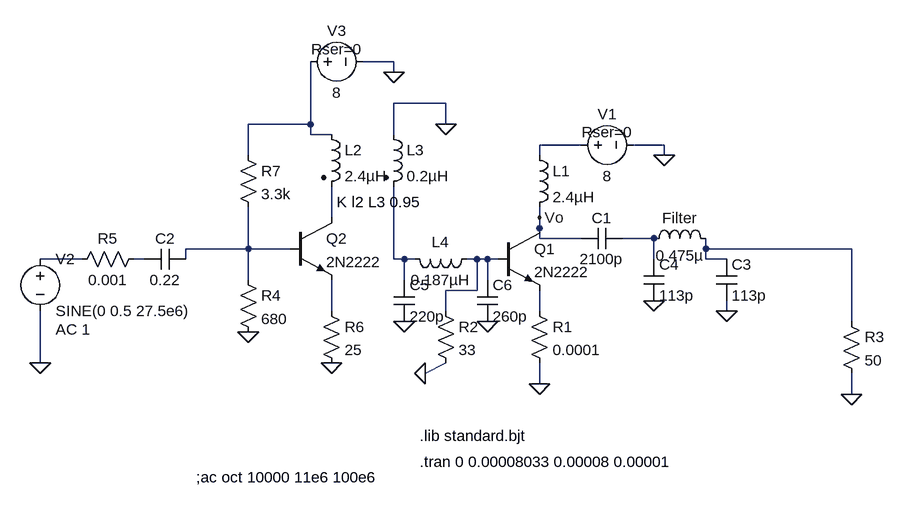
[diagram p0: schematic chian-27Mhz-improve.asc]
chian-27Mhz-improve.asc, the LTspice schematic file:
Version 4
SHEET 1 880 680
WIRE -32 -160 -80 -160
WIRE -32 -144 -32 -160
WIRE 48 -96 -32 -96
WIRE -160 -64 -160 -160
WIRE -160 -64 -256 -64
WIRE 48 -64 48 -96
WIRE -160 -48 -160 -64
WIRE -128 -48 -160 -48
WIRE -32 -48 -32 -96
WIRE 256 -32 192 -32
WIRE 384 -32 336 -32
WIRE -256 -16 -256 -64
WIRE 192 -16 192 -32
WIRE 384 -16 384 -32
WIRE -128 80 -128 32
WIRE 192 80 192 64
WIRE 192 96 192 80
WIRE 192 112 192 96
WIRE 256 112 192 112
WIRE 368 112 320 112
WIRE -256 128 -256 64
WIRE -256 128 -352 128
WIRE -192 128 -256 128
WIRE 448 128 448 112
WIRE 672 128 448 128
WIRE -512 144 -576 144
WIRE -416 144 -432 144
WIRE -352 144 -352 128
WIRE -32 144 -32 32
WIRE -16 144 -32 144
WIRE 0 144 -16 144
WIRE 96 144 80 144
WIRE 112 144 96 144
WIRE 128 144 112 144
WIRE 368 144 368 112
WIRE 448 144 448 128
WIRE 480 144 448 144
WIRE -256 176 -256 128
WIRE -16 176 -16 144
WIRE 112 176 112 144
WIRE 96 192 96 144
WIRE 96 192 48 192
WIRE -128 224 -128 176
WIRE 48 224 48 192
WIRE 192 224 192 192
WIRE 480 224 480 208
WIRE 672 240 672 128
WIRE -576 304 -576 224
WIRE 16 320 48 304
WIRE 192 336 192 304
WIRE 672 352 672 320
FLAG 192 336 0
FLAG 480 224 0
FLAG 384 -16 0
FLAG 672 352 0
FLAG -576 304 0
FLAG 192 80 Vo
FLAG 368 208 0
FLAG 16 320 0
FLAG -32 -144 0
FLAG -128 304 0
FLAG -256 256 0
FLAG 48 -64 0
FLAG 112 240 0
FLAG -16 240 0
SYMBOL res 176 208 R0
SYMATTR InstName R1
SYMATTR Value 0.0001
SYMATTR SpiceLine tol=1% pwr=1
SYMBOL ind 176 -32 R0
SYMATTR InstName L1
SYMATTR Value 2.4µH
SYMATTR SpiceLine Ipk=3 Rser=0.0478 Rpar=1e22 Cpar=0
SYMBOL ind 352 128 R270
WINDOW 0 32 56 VTop 2
WINDOW 3 5 56 VBottom 2
SYMATTR InstName Filter
SYMATTR Value 0.475µ
SYMATTR SpiceLine Ipk=1 Rser=0.03 Rpar=1e4 Cpar=0.3p
SYMBOL cap 464 144 R0
SYMATTR InstName C3
SYMATTR Value 113p
SYMATTR SpiceLine V=100 Irms=0.7 Rser=0.03 Lser=0 Rpar=1e5 Cpar=0
SYMBOL npn 128 96 R0
SYMATTR InstName Q1
SYMATTR Value 2N2222
SYMBOL res 656 224 R0
SYMATTR InstName R3
SYMATTR Value 50
SYMATTR SpiceLine tol=1% pwr=1
SYMBOL voltage 240 -32 R270
WINDOW 0 32 56 VTop 2
WINDOW 3 -32 56 VBottom 2
WINDOW 123 0 0 Left 2
WINDOW 39 4 56 VTop 2
SYMATTR InstName V1
SYMATTR Value 8
SYMATTR SpiceLine Rser=0
SYMBOL voltage -576 128 R0
WINDOW 123 24 124 Left 2
WINDOW 39 24 152 Left 2
SYMATTR Value2 AC 1
SYMATTR InstName V2
SYMATTR Value SINE(0 0.5 27.5e6)
SYMBOL res -528 160 R270
WINDOW 0 32 56 VTop 2
WINDOW 3 0 56 VBottom 2
SYMATTR InstName R5
SYMATTR Value 0.001
SYMATTR SpiceLine tol=1% pwr=1
SYMBOL cap 352 144 R0
SYMATTR InstName C4
SYMATTR Value 113p
SYMBOL res 32 208 R0
SYMATTR InstName R2
SYMATTR Value 33
SYMBOL cap -352 128 R90
WINDOW 0 0 32 VBottom 2
WINDOW 3 32 32 VTop 2
SYMATTR InstName C2
SYMATTR Value 0.22
SYMBOL cap 320 96 R90
WINDOW 0 0 32 VBottom 2
WINDOW 3 32 32 VTop 2
SYMATTR InstName C1
SYMATTR Value 2100p
SYMBOL npn -192 80 R0
SYMATTR InstName Q2
SYMATTR Value 2N2222
SYMBOL res -272 160 R0
SYMATTR InstName R4
SYMATTR Value 680
SYMBOL ind2 -144 -64 R0
SYMATTR InstName L2
SYMATTR Value 2.4µH
SYMATTR SpiceLine Ipk=3 Rser=0.0478 Rpar=1e22 Cpar=0
SYMATTR Type ind
SYMBOL ind2 -48 -64 R0
SYMATTR InstName L3
SYMATTR Value 0.2µH
SYMATTR SpiceLine Ipk=3 Rser=0.0478 Rpar=1e22 Cpar=0
SYMATTR Type ind
SYMBOL voltage -176 -160 R270
WINDOW 0 32 56 VTop 2
WINDOW 3 -32 56 VBottom 2
WINDOW 123 0 0 Left 2
WINDOW 39 4 56 VTop 2
SYMATTR InstName V3
SYMATTR Value 8
SYMATTR SpiceLine Rser=0
SYMBOL res -144 208 R0
SYMATTR InstName R6
SYMATTR Value 25
SYMBOL res -272 -32 R0
SYMATTR InstName R7
SYMATTR Value 3.3k
SYMBOL ind 96 128 R90
WINDOW 0 5 56 VBottom 2
WINDOW 3 32 56 VTop 2
SYMATTR InstName L4
SYMATTR Value 0.187µH
SYMBOL cap -32 176 R0
SYMATTR InstName C5
SYMATTR Value 220p
SYMBOL cap 96 176 R0
SYMATTR InstName C6
SYMATTR Value 260p
TEXT 8 416 Left 2 !.lib standard.bjt
TEXT 8 456 Left 2 !.tran 0 0.00008033 0.00008 0.00001
TEXT -336 480 Left 2 !;ac oct 10000 11e6 100e6
TEXT -120 56 Left 2 !K l2 L3 0.95

The netlist it stands for:
* chian-27Mhz-improve.asc
R1 N012 0 0.0001 tol=1% pwr=1
L1 N002 Vo 2.4µH Ipk=3 Rser=0.0478 Rpar=1e22 Cpar=0
L§Filter N004 N006 0.475µ Ipk=1 Rser=0.03 Rpar=1e4 Cpar=0.3p
C3 N006 0 113p V=100 Irms=0.7 Rser=0.03 Lser=0 Rpar=1e5 Cpar=0
Q1 Vo N010 N012 0 2N2222
R3 N006 0 50 tol=1% pwr=1
V1 N002 0 8 Rser=0
V2 N007 0 SINE(0 0.5 27.5e6) AC 1
R5 N007 N008 0.001 tol=1% pwr=1
C4 N004 0 113p
R2 N010 0 33
C2 N005 N008 0.22
C1 N004 Vo 2100p
Q2 N003 N005 N011 0 2N2222
R4 N005 0 680
L2 N001 N003 2.4µH Ipk=3 Rser=0.0478 Rpar=1e22 Cpar=0
L3 0 N009 0.2µH Ipk=3 Rser=0.0478 Rpar=1e22 Cpar=0
V3 N001 0 8 Rser=0
R6 N011 0 25
R7 N001 N005 3.3k
L4 N010 N009 0.187µH
C5 N009 0 220p
C6 N010 0 260p
.model NPN NPN
.model PNP PNP
.lib standard.bjt
.lib standard.bjt
.tran 0 0.00008033 0.00008 0.00001
;ac oct 10000 11e6 100e6
K l2 L3 0.95
.backanno
.end